# Altium project H3-chip-base.PrjPcb
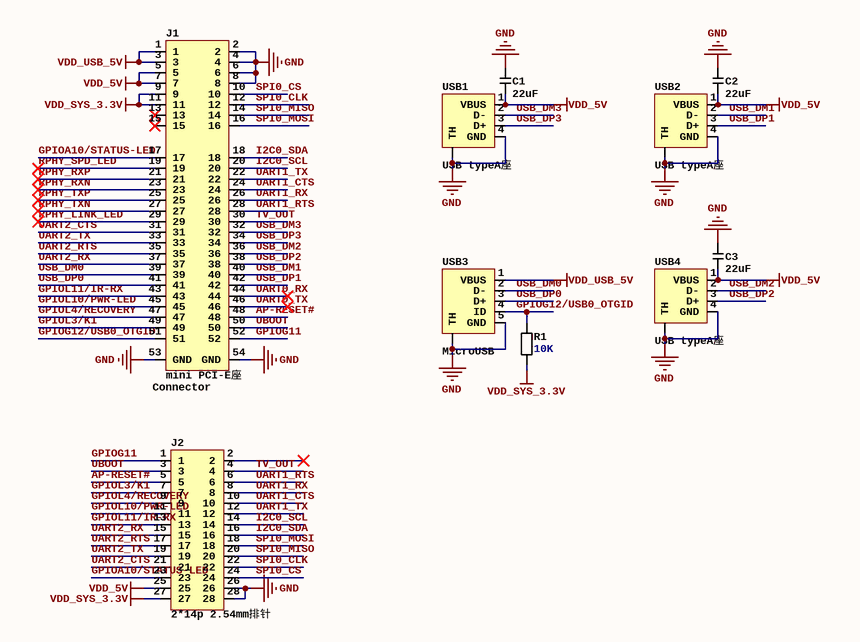
[diagram p0: H3-chip-base.SchDoc]
1 sheet, 10 parts. Net scope: global (net labels, ports and power ports of the same name join across sheets).
Board file: H3-chip-base.PcbDoc

## Sheet H3-chip-base.SchDoc
size A4

### Parts
C1  22uF  [CAP_0603]
C2  22uF  [CAP_0603]
C3  22uF  [CAP_0603]
J1  mini PCI-E座  System: Connector  [mini PCI-E座]
J2  2*14p 2.54mm排针  [2*14p 2.54mm排针]
R1  10K  [RES_0603]
USB1  USB typeA座  [USB typeA座]
USB2  USB typeA座  [USB typeA座]
USB3  MicroUSB  [MicroUSB]
USB4  USB typeA座  [USB typeA座]

### Nets
GND: C1.2 C2.2 C3.2 J1.2 J1.4 J1.6 J1.8 J1.53(GND) J1.54(GND) J2.26 J2.28 USB1.0(TH) USB1.4(GND) USB2.0(TH) USB2.4(GND) USB3.0(TH) USB3.5(GND) USB4.0(TH) USB4.4(GND)
VDD_5V: C1.1 C2.1 C3.1 J1.5 J1.7 J2.25 USB1.1(VBUS) USB2.1(VBUS) USB4.1(VBUS)
VDD_SYS_3.3V: J1.9 J1.11 J2.27 R1.1
VDD_USB_5V: J1.1 J1.3 USB3.1(VBUS)
AP-RESET#: J1.48 J2.5
GPIOA10/STATUS-LED: J1.17 J2.23
GPIOG11: J1.52 J2.1
GPIOG12/USB0_OTGID: J1.51 R1.2 USB3.4(ID)
GPIOL3/K1: J1.49 J2.7
GPIOL4/RECOVERY: J1.47 J2.9
GPIOL10/PWR-LED: J1.45 J2.11
GPIOL11/IR-RX: J1.43 J2.13
I2C0_SCL: J1.20 J2.14
I2C0_SDA: J1.18 J2.16
RPHY_LINK_LED: J1.29
RPHY_RXN: J1.23
RPHY_RXP: J1.21
RPHY_SPD_LED: J1.19
RPHY_TXN: J1.27
RPHY_TXP: J1.25
SPI0_CLK: J1.12 J2.22
SPI0_CS: J1.10 J2.24
SPI0_MISO: J1.14 J2.20
SPI0_MOSI: J1.16 J2.18
TV_OUT: J1.30 J2.4
UART0_RX: J1.44
UART0_TX: J1.46
UART1_CTS: J1.24 J2.10
UART1_RTS: J1.28 J2.6
UART1_RX: J1.26 J2.8
UART1_TX: J1.22 J2.12
UART2_CTS: J1.31 J2.21
UART2_RTS: J1.35 J2.17
UART2_RX: J1.37 J2.15
UART2_TX: J1.33 J2.19
UBOOT: J1.50 J2.3
USB_DM0: J1.39 USB3.2(D-)
USB_DM1: J1.40 USB2.2(D-)
USB_DM2: J1.36 USB4.2(D-)
USB_DM3: J1.32 USB1.2(D-)
USB_DP0: J1.41 USB3.3(D+)
USB_DP1: J1.42 USB2.3(D+)
USB_DP2: J1.38 USB4.3(D+)
USB_DP3: J1.34 USB1.3(D+)

Not connected (* = marked no-connect by the designer): J1 13* 15*; J2 2*

### Library data of the parts
C1-C3 = CAP_0603_22uF: 0603
R1 = RES_0603_10K: 0603